# Altium schematic sheet Sheet4.SchDoc
size A3; SheetNumber: 2; SheetTotal: 2
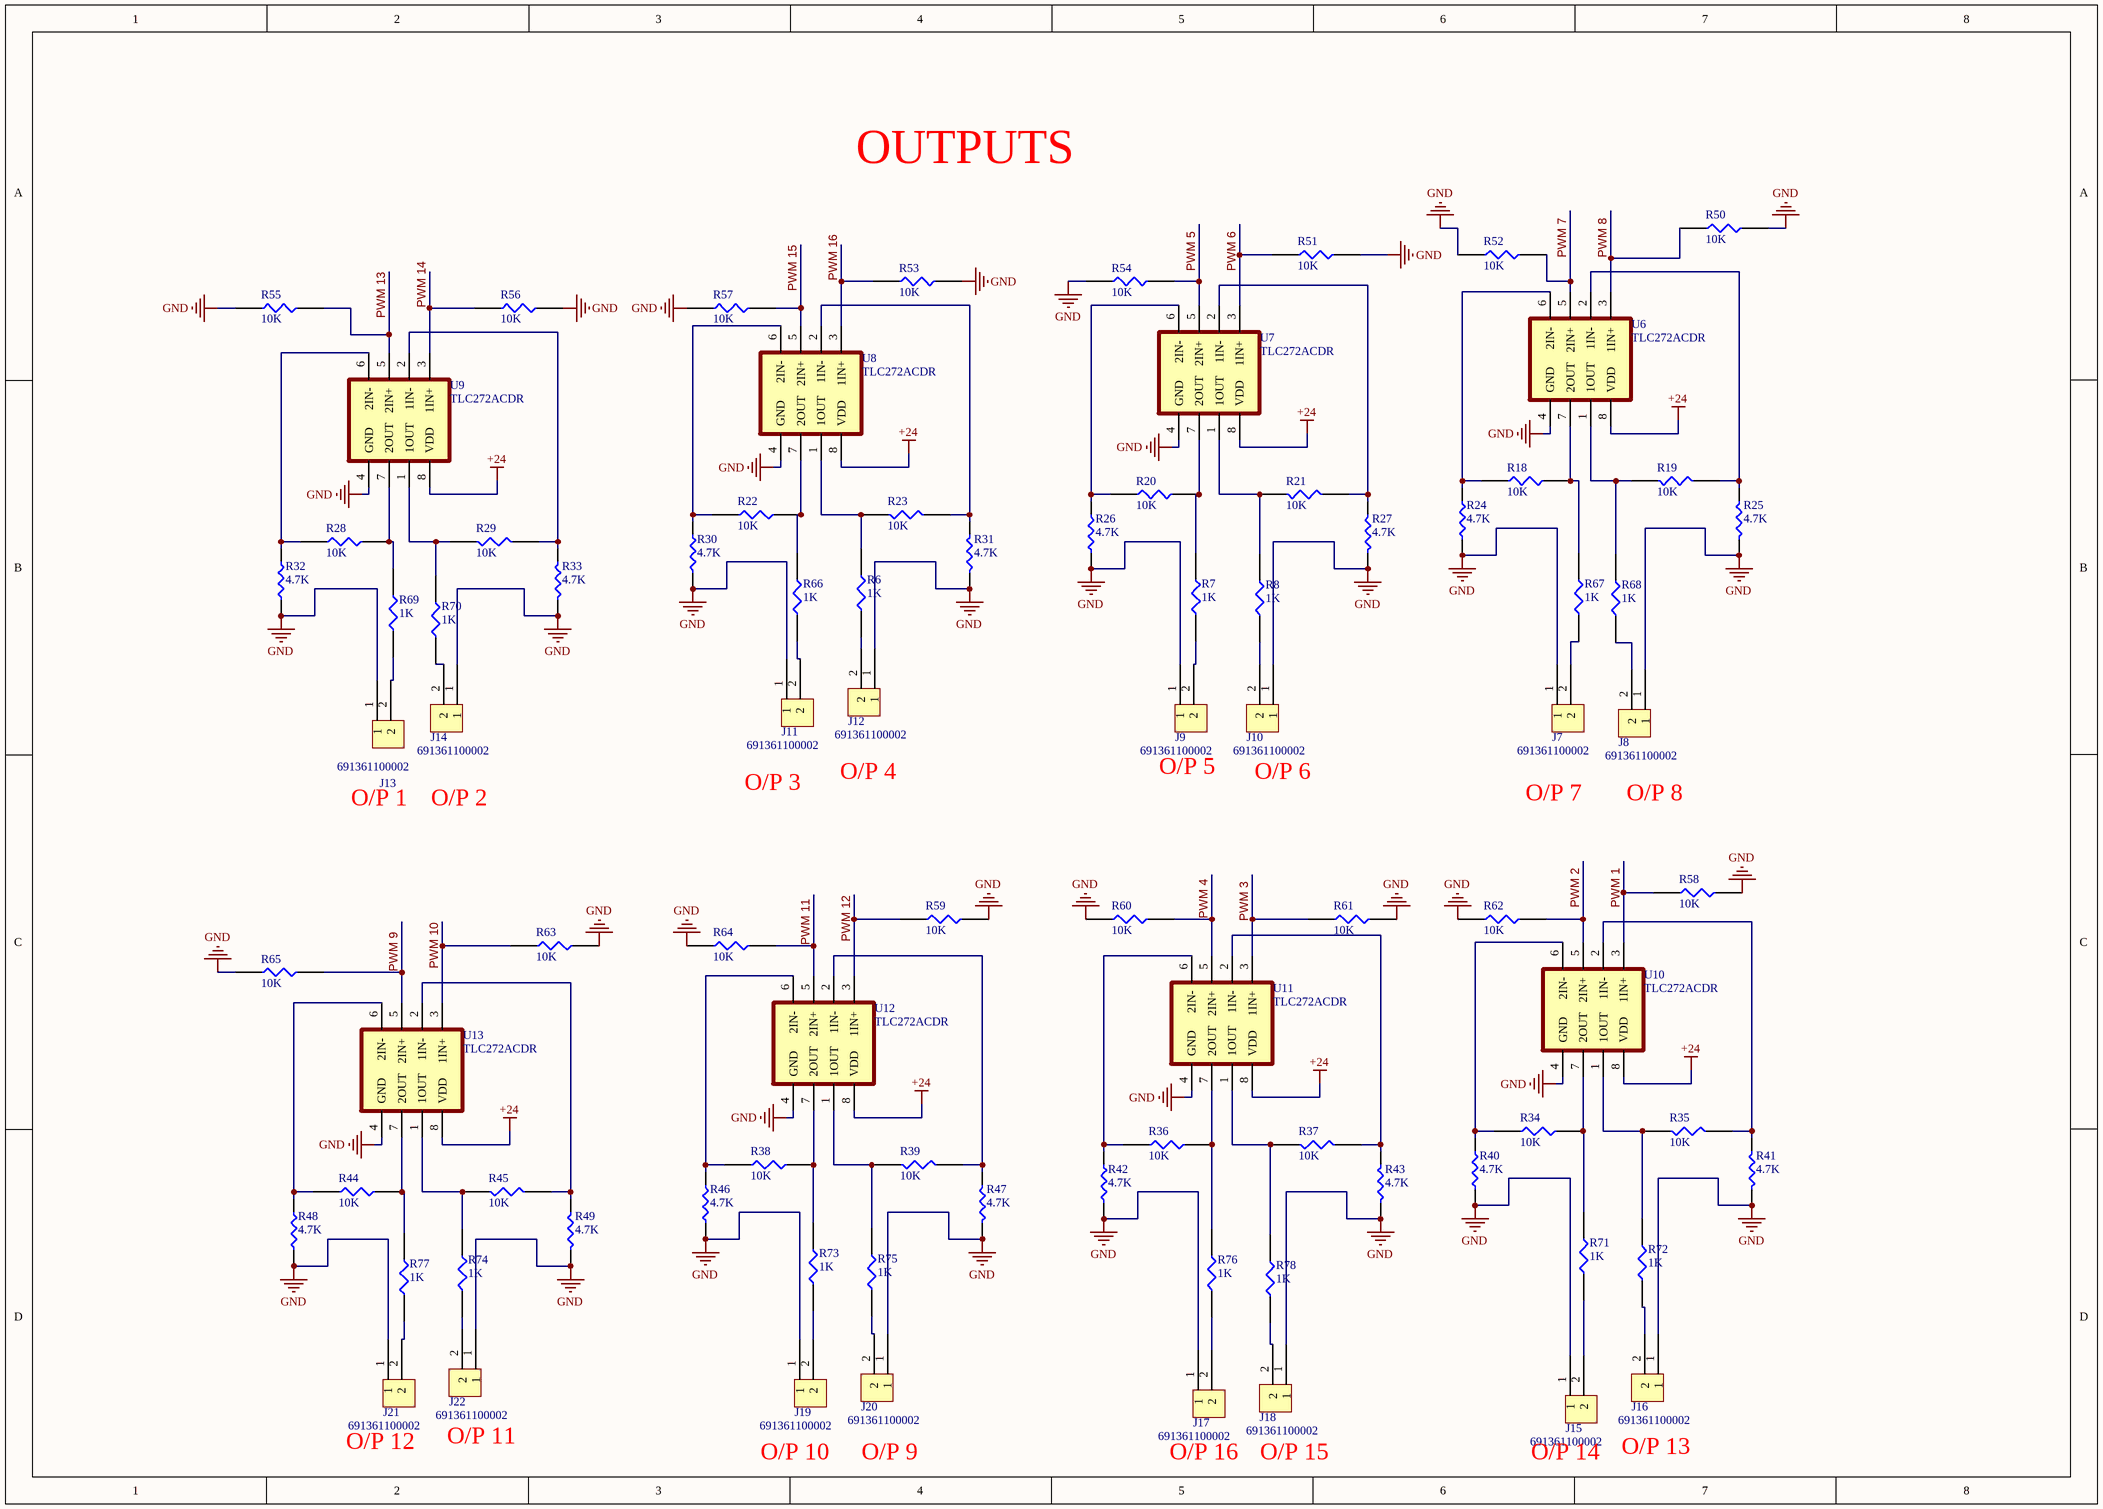
[diagram p0: Sheet4.SchDoc]

## Parts
J7  691361100002  [Screw Terminal 3.5mm]
J8  691361100002  [Screw Terminal 3.5mm]
J9  691361100002  [Screw Terminal 3.5mm]
J10  691361100002  [Screw Terminal 3.5mm]
J11  691361100002  [Screw Terminal 3.5mm]
J12  691361100002  [Screw Terminal 3.5mm]
J13  691361100002  [Screw Terminal 3.5mm]
J14  691361100002  [Screw Terminal 3.5mm]
J15  691361100002  [Screw Terminal 3.5mm]
J16  691361100002  [Screw Terminal 3.5mm]
J17  691361100002  [Screw Terminal 3.5mm]
J18  691361100002  [Screw Terminal 3.5mm]
J19  691361100002  [Screw Terminal 3.5mm]
J20  691361100002  [Screw Terminal 3.5mm]
J21  691361100002  [Screw Terminal 3.5mm]
J22  691361100002  [Screw Terminal 3.5mm]
R6  1K  [R_0805]
R7  1K  [R_0805]
R8  1K  [R_0805]
R18  10K  [R_0805]
R19  10K  [R_0805]
R20  10K  [R_0805]
R21  10K  [R_0805]
R22  10K  [R_0805]
R23  10K  [R_0805]
R24  4.7K  [R_0805]
R25  4.7K  [R_0805]
R26  4.7K  [R_0805]
R27  4.7K  [R_0805]
R28  10K  [R_0805]
R29  10K  [R_0805]
R30  4.7K  [R_0805]
R31  4.7K  [R_0805]
R32  4.7K  [R_0805]
R33  4.7K  [R_0805]
R34  10K  [R_0805]
R35  10K  [R_0805]
R36  10K  [R_0805]
R37  10K  [R_0805]
R38  10K  [R_0805]
R39  10K  [R_0805]
R40  4.7K  [R_0805]
R41  4.7K  [R_0805]
R42  4.7K  [R_0805]
R43  4.7K  [R_0805]
R44  10K  [R_0805]
R45  10K  [R_0805]
R46  4.7K  [R_0805]
R47  4.7K  [R_0805]
R48  4.7K  [R_0805]
R49  4.7K  [R_0805]
R50  10K  [R_0805]
R51  10K  [R_0805]
R52  10K  [R_0805]
R53  10K  [R_0805]
R54  10K  [R_0805]
R55  10K  [R_0805]
R56  10K  [R_0805]
R57  10K  [R_0805]
R58  10K  [R_0805]
R59  10K  [R_0805]
R60  10K  [R_0805]
R61  10K  [R_0805]
R62  10K  [R_0805]
R63  10K  [R_0805]
R64  10K  [R_0805]
R65  10K  [R_0805]
R66  1K  [R_0805]
R67  1K  [R_0805]
R68  1K  [R_0805]
R69  1K  [R_0805]
R70  1K  [R_0805]
R71  1K  [R_0805]
R72  1K  [R_0805]
R73  1K  [R_0805]
R74  1K  [R_0805]
R75  1K  [R_0805]
R76  1K  [R_0805]
R77  1K  [R_0805]
R78  1K  [R_0805]
U6  TLC272ACDR  [8 SOIC]
U7  TLC272ACDR  [8 SOIC]
U8  TLC272ACDR  [8 SOIC]
U9  TLC272ACDR  [8 SOIC]
U10  TLC272ACDR  [8 SOIC]
U11  TLC272ACDR  [8 SOIC]
U12  TLC272ACDR  [8 SOIC]
U13  TLC272ACDR  [8 SOIC]

## Nets
+24: U6.8(VDD) U7.8(VDD) U8.8(VDD) U9.8(VDD) U10.8(VDD) U11.8(VDD) U12.8(VDD) U13.8(VDD)
GND: J7.1 J8.1 J9.1 J10.1 J11.1 J12.1 J13.1 J14.1 J15.1 J16.1 J17.1 J18.1 J19.1 J20.1 J21.1 J22.1 R24.1 R25.1 R26.1 R27.1 R30.1 R31.1 R32.1 R33.1 R40.1 R41.1 R42.1 R43.1 R46.1 R47.1 R48.1 R49.1 R50.2 R51.2 R52.1 R53.2 R54.1 R55.1 R56.2 R57.1 R58.2 R59.2 R60.1 R61.2 R62.1 R63.2 R64.1 R65.1 U6.4(GND) U7.4(GND) U8.4(GND) U9.4(GND) U10.4(GND) U11.4(GND) U12.4(GND) U13.4(GND)
PWM 1: R58.1 U10.3(1IN+)
PWM 2: R62.2 U10.5(2IN+)
PWM 3: R61.1 U11.3(1IN+)
PWM 4: R60.2 U11.5(2IN+)
PWM 5: R54.2 U7.5(2IN+)
PWM 6: R51.1 U7.3(1IN+)
PWM 7: R52.2 U6.5(2IN+)
PWM 8: R50.1 U6.3(1IN+)
PWM 9: R65.2 U13.5(2IN+)
PWM 10: R63.1 U13.3(1IN+)
PWM 11: R64.2 U12.5(2IN+)
PWM 12: R59.1 U12.3(1IN+)
PWM 13: R55.2 U9.5(2IN+)
PWM 14: R56.1 U9.3(1IN+)
PWM 15: R57.2 U8.5(2IN+)
PWM 16: R53.1 U8.3(1IN+)
NetJ7_2: J7.2 R67.1
NetJ8_2: J8.2 R68.1
NetJ9_2: J9.2 R7.1
NetJ10_2: J10.2 R8.1
NetJ11_2: J11.2 R66.1
NetJ12_2: J12.2 R6.1
NetJ13_2: J13.2 R69.1
NetJ14_2: J14.2 R70.1
NetJ15_2: J15.2 R71.1
NetJ16_2: J16.2 R72.1
NetJ17_2: J17.2 R76.1
NetJ18_2: J18.2 R78.1
NetJ19_2: J19.2 R73.1
NetJ20_2: J20.2 R75.1
NetJ21_2: J21.2 R77.1
NetJ22_2: J22.2 R74.1
NetR6_2: R6.2 R23.2 U8.1(1OUT)
NetR7_2: R7.2 R20.2 U7.7(2OUT)
NetR8_2: R8.2 R21.2 U7.1(1OUT)
NetR18_1: R18.1 R24.2 U6.6(2IN-)
NetR18_2: R18.2 R67.2 U6.7(2OUT)
NetR19_1: R19.1 R25.2 U6.2(1IN-)
NetR19_2: R19.2 R68.2 U6.1(1OUT)
NetR20_1: R20.1 R26.2 U7.6(2IN-)
NetR21_1: R21.1 R27.2 U7.2(1IN-)
NetR22_1: R22.1 R30.2 U8.6(2IN-)
NetR22_2: R22.2 R66.2 U8.7(2OUT)
NetR23_1: R23.1 R31.2 U8.2(1IN-)
NetR28_1: R28.1 R32.2 U9.6(2IN-)
NetR28_2: R28.2 R69.2 U9.7(2OUT)
NetR29_1: R29.1 R33.2 U9.2(1IN-)
NetR29_2: R29.2 R70.2 U9.1(1OUT)
NetR34_1: R34.1 R40.2 U10.6(2IN-)
NetR34_2: R34.2 R71.2 U10.7(2OUT)
NetR35_1: R35.1 R41.2 U10.2(1IN-)
NetR35_2: R35.2 R72.2 U10.1(1OUT)
NetR36_1: R36.1 R42.2 U11.6(2IN-)
NetR36_2: R36.2 R76.2 U11.7(2OUT)
NetR37_1: R37.1 R43.2 U11.2(1IN-)
NetR37_2: R37.2 R78.2 U11.1(1OUT)
NetR38_1: R38.1 R46.2 U12.6(2IN-)
NetR38_2: R38.2 R73.2 U12.7(2OUT)
NetR39_1: R39.1 R47.2 U12.2(1IN-)
NetR39_2: R39.2 R75.2 U12.1(1OUT)
NetR44_1: R44.1 R48.2 U13.6(2IN-)
NetR44_2: R44.2 R77.2 U13.7(2OUT)
NetR45_1: R45.1 R49.2 U13.2(1IN-)
NetR45_2: R45.2 R74.2 U13.1(1OUT)

## Notes on the sheet
- OUTPUTS
- O/P 4
- O/P 5
- O/P 6
- O/P 1
- O/P 2
- O/P 3
- O/P 7
- O/P 8
- O/P 12
- O/P 11
- O/P 10
- O/P 9
- O/P 16
- O/P 15
- (near J15) O/P 14
- O/P 13

## Library data of the parts
J7-J22 = Screw Tarminal 3.5mm pitch: 3611 Series 3.5mm Pitch Straight Pluggable Term Block; Plug; Cable Mount; 2 Way; Manufacturer: Wurth Electronics; Current Rating: 10A; Voltage Rating: 300V; Number of Positions Per Level: 2; Number of Levels: 1; Wire/Cable Gauge: 26AWG; Wire Gauge (Min): 16AWG; Pitch: 0.138inch; Stripping Length: -7mm; Supplier 1: RSComponents; Manufacturer Part Number: 691361100002; RoHS: Yes; Category: Terminal Blocks; Stock 1: 1; Pricing 1: 1=2.51400, 10=2.28700, 50=2.12400, 100=2.02300, 250=1.93500 (USD); Mount: Free Hanging; Color: Green; Contact Material: Brass; Package Quantity: 650; Packaging: Bulk; Termination: Screw; Current: 10A; Voltage: 300V; Number of Contacts: 2; Series: WR-TBL Series 3611; Length: 15.8mm; Width: 3.5mm; Height: 11.1mm; Wire Gauge (Max): 26AWG; REACH SVHC: Unknown; RoHS Compliant: Yes; Lead Free: Lead Free; ComponentLink1URL: https://datasheet.ciiva.com/7992/1442235-7992395.pdf?src-supplier=Element14; ComponentLink1Description: https://datasheet.ciiva.com/7992/1442235-7992395.pdf?src-supplier=Element14; ComponentLink2URL: https://datasheet.ciiva.com/796/6913611000xx-796028.pdf?src-supplier=Digi-Key; ComponentLink2Description: https://datasheet.ciiva.com/796/6913611000xx-796028.pdf?src-supplier=Digi-Key; Supplier Part Number 1: 8250806
R6-R8 R66-R78 = RES_1_K_0805: 贴片电阻 1000Ω ± 1.00% 0.125W ± 100ppm/℃ 0805; Manufacturer: Yageo; Manufacturer Part Number: RC0805FR-071KL; Tolerance: 1%; Resistance: 1kR; Temperature Coefficient: 100ppm/°C; Voltage Rating (DC): 150V; Power Rating: 125mW; Supplier 1: Future Electronics; RoHS: Yes; Category: Chip SMD Resistors; Stock 1: 10195000; Pricing 1: 5000=0.00390 (USD); Case/Package: 0805; Number of Pins: 2; Case Code (Metric): 2012; Case Code (Imperial): 0805; Size Code: 0805; Min Operating Temperature: -55°C; Max Operating Temperature: 155°C; Packaging: Tape and Reel; Resistor Type: Thick Film; Package Quantity: 1; Voltage Rating: 150V; Number of Terminations: 2; Termination: SMD/SMT; Max Power Dissipation: 125mW; Features: Moisture Resistant; Series: RC; Resistance Tolerance: 1%; Construction: Rectangular; Length: 0.079inch; Width: 0.049inch; Height: 0.024inch; Depth: 1.25mm; REACH SVHC: Unknown; Lead Free: Lead Free; RoHS Compliant: Yes; Military Standard: Not; ComponentLink1URL: https://datasheet.ciiva.com/7941/1686128-7941719.pdf?src-supplier=Element14; ComponentLink1Description: https://datasheet.ciiva.com/7941/1686128-7941719.pdf?src-supplier=Element14; ComponentLink2URL: https://datasheet.ciiva.com/46385/444164-46385020.pdf?src-supplier=Element14; ComponentLink2Description: https://datasheet.ciiva.com/46385/444164-46385020.pdf?src-supplier=Element14; ComponentLink3URL: https://datasheet.ciiva.com/2456/pyu-r-int-thick-7-2456976.pdf?src-supplier=Digi-Key; ComponentLink3Description: https://datasheet.ciiva.com/2456/pyu-r-int-thick-7-2456976.pdf?src-supplier=Digi-Key; ComponentLink4URL: https://datasheet.ciiva.com/2456/pyu-r-int-thick-7-2456977.pdf?src-supplier=Digi-Key; ComponentLink4Description: https://datasheet.ciiva.com/2456/pyu-r-int-thick-7-2456977.pdf?src-supplier=Digi-Key; ComponentLink5URL: https://datasheet.ciiva.com/2456/pyu-r-int-thick-7-2456975.pdf?src-supplier=Digi-Key; ComponentLink5Description: https://datasheet.ciiva.com/2456/pyu-r-int-thick-7-2456975.pdf?src-supplier=Digi-Key; ComponentLink6URL: https://datasheet.ciiva.com/16850/rc0805-16850409.pdf?src-supplier=Future+Electronics; ComponentLink6Description: https://datasheet.ciiva.com/16850/rc0805-16850409.pdf?src-supplier=Future+Electronics; Supplier Part Number 1: 8126013
R18-R23 R28 R29 R34-R39 R44 R45 R50-R65 = RES_10_K_0805: 贴片电阻 10000Ω ± 1.00% 0.125W ± 100ppm/℃ 0805; Manufacturer: Yageo; Manufacturer Part Number: RC0805FR-0710KL; Resistance: 10kR; Tolerance: 1%; Temperature Coefficient: 100ppm/°C; Power Rating: 125mW; Voltage Rating: 150V; Supplier 1: Avnet; RoHS: Yes; Category: Chip SMD Resistors; Stock 1: 725000; Pricing 1: 5000=0.00227, 10000=0.00224, 20000=0.00217 (USD); Case/Package: 0805; Case Code (Imperial): 0805; Case Code (Metric): 2012; Size Code: 0805; Min Operating Temperature: -55°C; Max Operating Temperature: 155°C; Packaging: Tape and Reel; Resistor Type: Thick Film; Package Quantity: 1; Termination: SMD/SMT; Number of Terminations: 2; Max Power Dissipation: 125mW; Features: Moisture Resistant; Series: RC; Construction: Rectangular; Resistance Tolerance: 1%; Technology: THICK FILM; Length: 2mm; Width: 0.049inch; Height: 0.024inch; Depth: 1.25mm; REACH SVHC: Unknown; Lead Free: Lead Free; Military Standard: Not; RoHS Compliant: Yes; Supplier Part Number 1: RC0805FR-0710KL
R24-R27 R30-R33 R40-R43 R46-R49 = Res 4.7 K: Res Thick Film 0805 4.7K Ohm 1% 0.125W ±100ppm/°C Molded SMD Paper T/R; Manufacturer: Stackpole Electronics; Manufacturer Part Number: RMCF0805FT4K70; Resistance: 4.7kR; Power Rating: 125mW; Supplier 1: Avnet; RoHS: Yes; Category: Chip SMD Resistors; Stock 1: 3000000; Pricing 1: 5000=0.00256, 10000=0.00252, 20000=0.00245, 30000=0.00239, 40000=0.00230, 50000=0.00225, 500000=0.00220 (USD); Mount: Surface Mount; Case/Package: 0805; Case Code (Metric): 2012; Case Code (Imperial): 0805; Contact Plating: Tin,Matte; Size Code: 0805; Min Operating Temperature: -55°C; Max Operating Temperature: 155°C; Tolerance: 1%; Packaging: Tape and Reel; Resistor Type: Thick Film; Number of Terminations: 2; Max Power Dissipation: 125mW; Temperature Coefficient: 100ppm/°C; Features: Automotive AEC-Q200; Series: RMCF; Construction: Rectangular; Length: 2mm; Width: 0.049inch; Height: 0.026inch; Depth: 1.25mm; Radiation Hardening: No; Military Standard: Not; Lead Free: Lead Free; RoHS Compliant: Yes; ComponentLink1URL: https://www.seielect.com/Catalog/SEI-RMCF_RMCP.pdf?src-supplier=Digi-Key; ComponentLink1Description: https://www.seielect.com/Catalog/SEI-RMCF_RMCP.pdf?src-supplier=Digi-Key; ComponentLink2URL: https://www.verical.com/server-webapp/html/getDatasheet?partID=409513&src-supplier=Verical; ComponentLink2Description: https://www.verical.com/server-webapp/html/getDatasheet?partID=409513&src-supplier=Verical; ComponentLink3URL: https://www.seielect.com/catalog/SEI-RMCF_RMCP.pdf?src-supplier=Avnet; ComponentLink3Description: https://www.seielect.com/catalog/SEI-RMCF_RMCP.pdf?src-supplier=Avnet; ComponentLink4URL: http://www.seielect.com/catalog/sei-rmc.pdf?src-supplier=Future+Electronics; ComponentLink4Description: http://www.seielect.com/catalog/sei-rmc.pdf?src-supplier=Future+Electronics; ComponentLink5URL: https://www.seielect.com/catalog/SEI-Packaging.pdf?src-supplier=Digi-Key; ComponentLink5Description: https://www.seielect.com/catalog/SEI-Packaging.pdf?src-supplier=Digi-Key; ComponentLink6URL: http://components.arrow.com/part/dataview/44988207S7163511N1174?src-supplier=Arrow+Electronics; ComponentLink6Description: http://components.arrow.com/part/dataview/44988207S7163511N1174?src-supplier=Arrow+Electronics; Supplier Part Number 1: RMCF0805FT4K70
U6-U13 = TLC272ACDR: Op Amp, 1.7MHZ, 3.6V/US, SOIC-8; Bandwid; Msl: Msl 1 - Unlimited; Svhc: No Svhc (15-JAN-2019); Manufacturer: Texas Instruments; Max Supply Voltage: 16V; Min Supply Voltage: 3V; Voltage Gain: 87.23dB; Nominal Supply Current: 4mA; Common Mode Rejection Ratio: 65dB; Number of Channels: 2; Slew Rate: 3.6V/µs; Max I/O Voltage: 5mV; Input Bias Current: 60pA; Operating Supply Current: 1.9mA; Output Current per Channel: 30mA; Power Dissipation: 725mW; Amplifier Type: GENERAL PURPOSE; Supplier 1: Arrow Electronics; Manufacturer Part Number: TLC272ACDR; RoHS: Yes; Category: Amplifiers - Op Amps, Buffer, Instrumentation; Stock 1: 645; Pricing 1: 1=1.50230, 10=1.34260, 25=1.26420, 100=1.03180, 250=0.95600, 500=0.83810 (USD); Case/Package: D; Number of Pins: 8; Contact Plating: Gold; Min Operating Temperature: -40°C; Max Operating Temperature: 85°C; Bandwidth: 1.7MHz; Packaging: Tape and Reel; Unity Gain Bandwidth Product: 1.7MHz; Package Quantity: 1; Nominal Gain Bandwidth Product: 1.7MHz; Input Offset Voltage (Vos): 5mV; Gain Bandwidth Product: 1.7MHz; Number of Circuits: 2; Number of Elements: 2; Supply Current: 4mA; Series: LinCMOS™; Number of Amplifiers: 2; Max Power Dissipation: 725mW; Radiation Hardening: No; Lead Free: Lead Free; RoHS Compliant: Yes; REACH SVHC: No SVHC; ComponentLink1URL: https://datasheet.ciiva.com/1796/tlc272a-1796251.pdf?src-supplier=Digi-Key; ComponentLink1Description: https://datasheet.ciiva.com/1796/tlc272a-1796251.pdf?src-supplier=Digi-Key; ComponentLink2URL: https://datasheet.ciiva.com/1796/tlc272a-1796250.pdf?src-supplier=Digi-Key; ComponentLink2Description: https://datasheet.ciiva.com/1796/tlc272a-1796250.pdf?src-supplier=Digi-Key; ComponentLink3URL: https://datasheet.ciiva.com/1796/tlc272a-1796252.pdf?src-supplier=Digi-Key; ComponentLink3Description: https://datasheet.ciiva.com/1796/tlc272a-1796252.pdf?src-supplier=Digi-Key; ComponentLink4URL: https://datasheet.ciiva.com/7710/1831142-7710123.pdf?src-supplier=Element14; ComponentLink4Description: https://datasheet.ciiva.com/7710/1831142-7710123.pdf?src-supplier=Element14; Supplier Part Number 1: TLC272ACDR